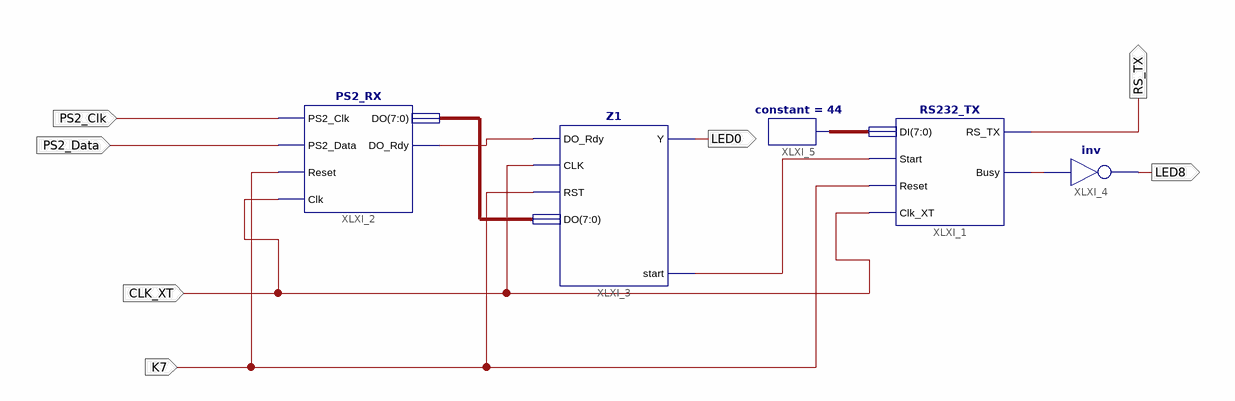
[diagram p0: schematic sheet 1]
// Xilinx ISE schematic SchematZ2.sch (xc9500xl) as structural Verilog: 5 symbols, 7 ports
module SchematZ2 (
  input  K7,
  input  CLK_XT,
  input  PS2_Clk,
  input  PS2_Data,
  output RS_TX,
  output LED8,
  output LED0
);

  wire XLXN_11, XLXN_16, XLXN_20;
  wire [7:0] XLXN_18, XLXN_22;

  RS232_TX XLXI_1 (.RS_TX(RS_TX), .Start(XLXN_20), .DI(XLXN_22), .Clk_XT(CLK_XT), .Reset(K7), .Busy(XLXN_16));
  PS2_RX XLXI_2 (.PS2_Clk(PS2_Clk), .PS2_Data(PS2_Data), .Clk(CLK_XT), .Reset(K7), .DO_Rdy(XLXN_11), .DO(XLXN_18));
  Z1 XLXI_3 (.DO_Rdy(XLXN_11), .CLK(CLK_XT), .RST(K7), .DO(XLXN_18), .Y(LED0), .start(XLXN_20));
  not XLXI_4 (LED8, XLXN_16);
  constant #(.CValue("44")) XLXI_5 (.O(XLXN_22));
endmodule
